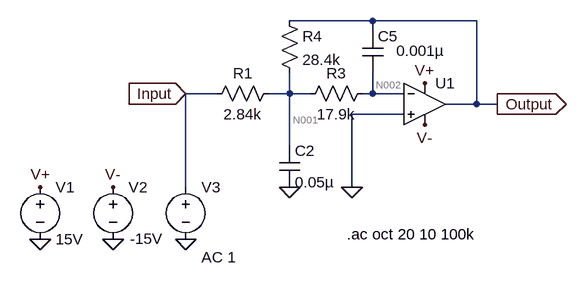
[diagram p0: schematic 2-1.asc]
2-1.asc, the LTspice schematic file:
Version 4
SHEET 1 908 680
WIRE 576 -48 448 -48
WIRE 736 -48 576 -48
WIRE 576 -32 576 -48
WIRE 336 64 288 64
WIRE 448 64 448 32
WIRE 448 64 416 64
WIRE 480 64 448 64
WIRE 576 64 576 32
WIRE 576 64 560 64
WIRE 624 64 576 64
WIRE 736 80 736 -48
WIRE 736 80 688 80
WIRE 768 80 736 80
WIRE 624 96 544 96
WIRE 448 144 448 64
WIRE 288 208 288 64
WIRE 544 208 544 96
FLAG 64 288 0
FLAG 176 288 0
FLAG 288 288 0
FLAG 64 208 V+
FLAG 176 208 V-
FLAG 448 208 0
FLAG 544 208 0
FLAG 656 112 V-
FLAG 656 48 V+
FLAG 768 80 Output
IOPIN 768 80 Out
FLAG 288 64 Input
IOPIN 288 64 In
SYMBOL voltage 64 192 R0
SYMATTR InstName V1
SYMATTR Value 15V
SYMBOL voltage 176 192 R0
WINDOW 3 26 95 Left 2
SYMATTR Value -15V
SYMATTR InstName V2
SYMBOL voltage 288 192 R0
WINDOW 123 24 124 Left 2
WINDOW 39 0 0 Left 0
SYMATTR Value2 AC 1
SYMATTR InstName V3
SYMATTR Value ""
SYMBOL res 432 48 R90
WINDOW 0 0 56 VBottom 2
WINDOW 3 32 56 VTop 2
SYMATTR InstName R1
SYMATTR Value 2.84k
SYMBOL res 576 48 R90
WINDOW 0 0 56 VBottom 2
WINDOW 3 32 56 VTop 2
SYMATTR InstName R3
SYMATTR Value 17.9k
SYMBOL res 432 -64 R0
SYMATTR InstName R4
SYMATTR Value 28.4k
SYMBOL cap 432 144 R0
SYMATTR InstName C2
SYMATTR Value 0.05µ
SYMBOL OpAmps\\UniversalOpAmp2 656 80 R0
SYMATTR InstName U1
SYMBOL cap 560 -32 R0
WINDOW 3 52 30 Left 2
SYMATTR Value 0.001µ
SYMATTR InstName C5
TEXT 536 280 Left 2 !.ac oct 20 10 100k

The netlist it stands for:
* 2-1.asc
V1 V+ 0 15V
V2 V- 0 -15V
V3 Input 0 AC 1
R1 N001 Input 2.84k
R3 N002 N001 17.9k
R4 Output N001 28.4k
C2 N001 0 0.05µ
XU1 0 N002 V+ V- Output level2 Avol=1Meg GBW=10Meg Slew=10Meg Ilimit=25m Rail=0 Vos=0 En=0 Enk=0 In=0 Ink=0 Rin=500Meg  ; pins In+ In- V+ V- OUT
C5 Output N002 0.001µ
.ac oct 20 10 100k
.lib UniversalOpAmp2.lib
.backanno
.end

* Results of the author's LTspice run, read from the files saved beside the schematic
* Operating Point, zero values left out:
*   V(v+) = 15 V
*   V(v-) = -15 V
*   I(V1) = -1.498 mA
*   I(V2) = 1.498 mA
*   Ix(u1:3) = 1.498 mA
*   Ix(u1:4) = -1.498 mA
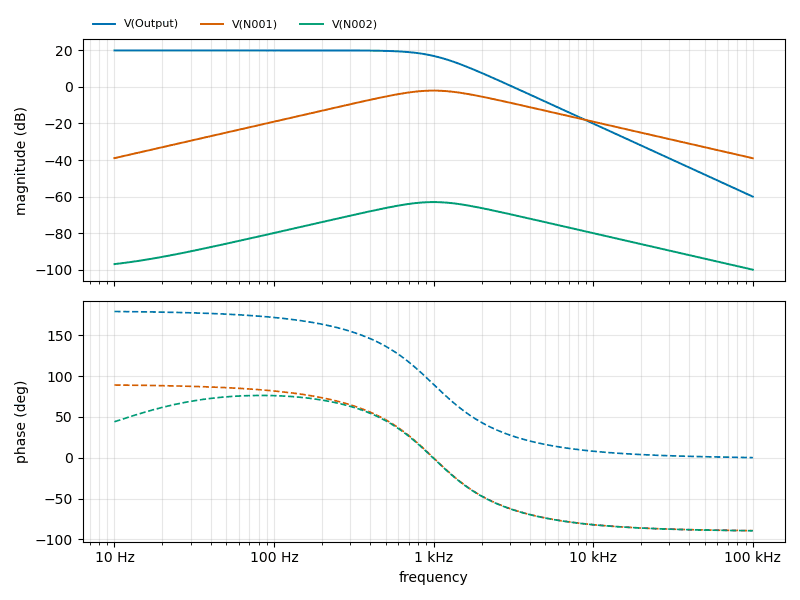
[diagram p1: AC Analysis of 2-1.asc, plotted from the saved traces]
* AC Analysis, 1 run:
*   V(Output): 20.00 dB at 10 Hz, -60.04 dB at 100 kHz, peak 20.00 dB at 31.38 Hz, 3 dB below the peak at 998.1 Hz
*   V(N001): -38.97 dB at 10 Hz, -39.01 dB at 100 kHz, peak -2.00 dB at 1.004 kHz, 3 dB below the peak at 516.7 Hz and 1.927 kHz
*   V(N002): -96.97 dB at 10 Hz, -100.02 dB at 100 kHz, peak -63.01 dB at 1.004 kHz, 3 dB below the peak at 516.6 Hz and 1.927 kHz